# EAGLE schematic TM4C1 (EAGLE 9.6.2)
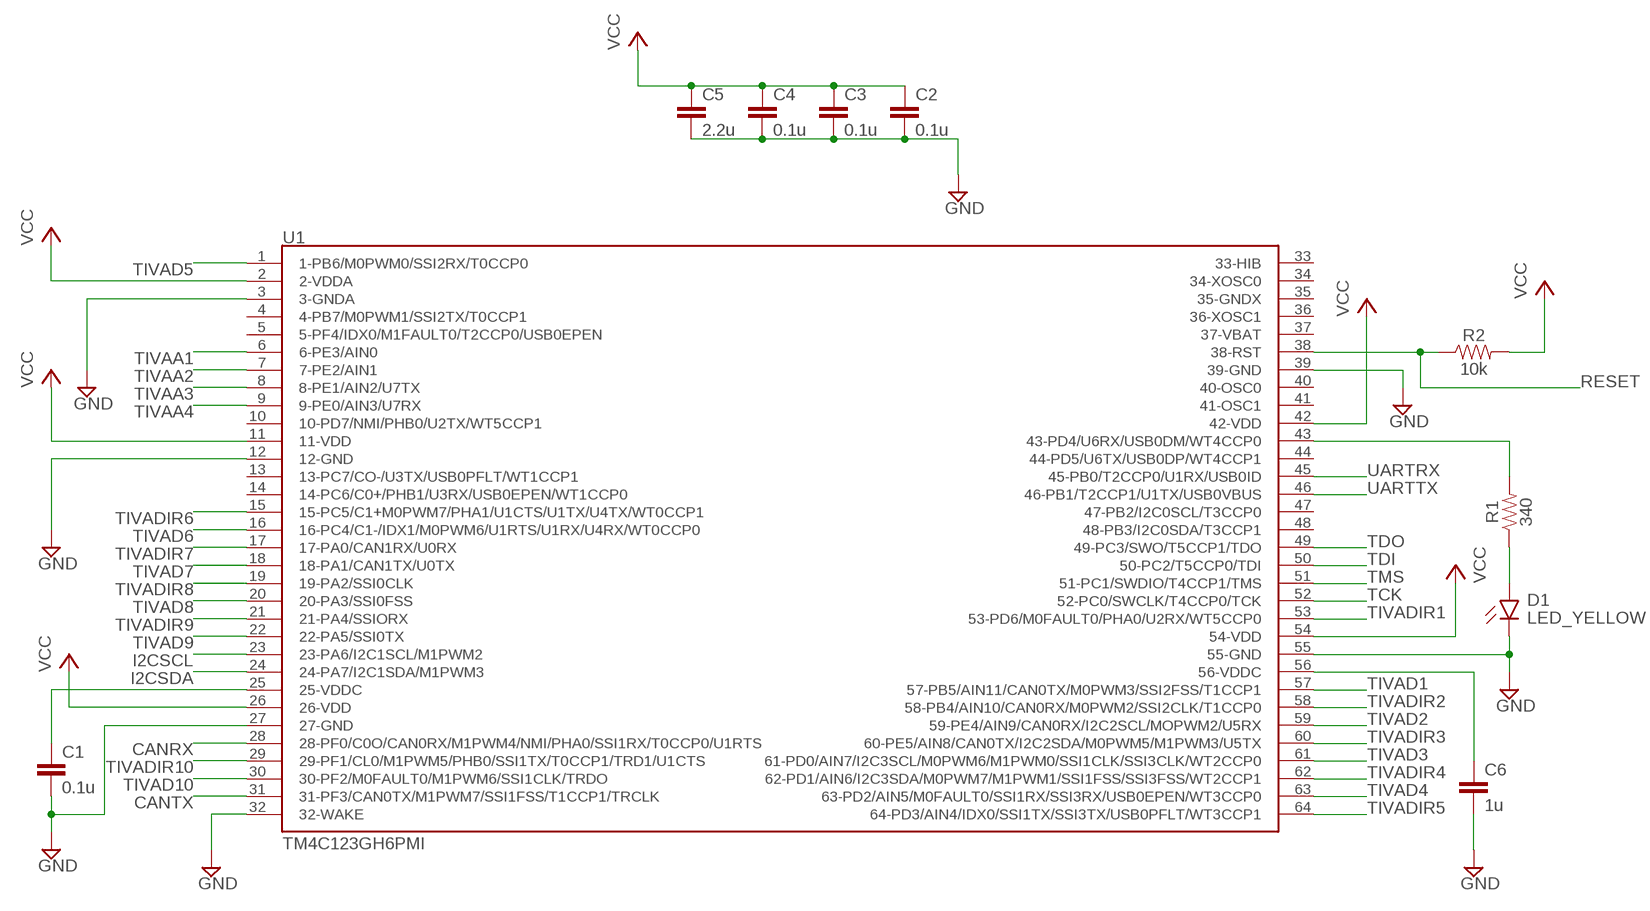
[diagram p0: schematic, sheet 1]

## Parts
C1  0.1u  CAP-0.1UF-0603-25V-X8R  [C0603]
C2  0.1u  CAP-0.1UF-0603-25V-X8R  [C0603]
C3  0.1u  CAP-0.1UF-0603-25V-X8R  [C0603]
C4  0.1u  CAP-0.1UF-0603-25V-X8R  [C0603]
C5  2.2u  CAP-2.2UF-0603-6.3V-X7R  [C0603]
C6  1u  CAP-1UF-0603-25V-X7R  [C0603]
D1  LED_YELLOW  CHIP-FLAT-Y_0603-0.35MM  [LEDC1608X35N_FLAT-Y]
R1  340  RES-340OHM-0603-1/10W-1%  [R0603]
R2  10k  RES-10KOHM-0603-1/10W-1%  [R0603]
U1  TM4C123GH6PMI  [S-PQFP-G64]

## Nets
CANRX: U1.28(28-PF0/C0O/CAN0RX/M1PWM4/NMI/PHA0/SSI1RX/T0CCP0/U1RTS)
CANTX: U1.31(31-PF3/CAN0TX/M1PWM7/SSI1FSS/T1CCP1/TRCLK)
GND: C1.2 C2.2 C3.2 C4.2 C5.2 C6.2 D1.C U1.3(3-GNDA) U1.12(12-GND) U1.27(27-GND) U1.32(32-WAKE) U1.39(39-GND) U1.55(55-GND)
I2CSCL: U1.23(23-PA6/I2C1SCL/M1PWM2)
I2CSDA: U1.24(24-PA7/I2C1SDA/M1PWM3)
N$1: R1.2 U1.43(43-PD4/U6RX/USB0DM/WT4CCP0)
N$2: D1.A R1.1
N$5: C1.1 U1.25(25-VDDC)
N$8: C6.1 U1.56(56-VDDC)
RESET: R2.1 U1.38(38-RST)
TCK: U1.52(52-PC0/SWCLK/T4CCP0/TCK)
TDI: U1.50(50-PC2/T5CCP0/TDI)
TDO: U1.49(49-PC3/SWO/T5CCP1/TDO)
TIVAA1: U1.6(6-PE3/AIN0)
TIVAA2: U1.7(7-PE2/AIN1)
TIVAA3: U1.8(8-PE1/AIN2/U7TX)
TIVAA4: U1.9(9-PE0/AIN3/U7RX)
TIVAD1: U1.57(57-PB5/AIN11/CAN0TX/M0PWM3/SSI2FSS/T1CCP1)
TIVAD2: U1.59(59-PE4/AIN9/CAN0RX/I2C2SCL/MOPWM2/U5RX)
TIVAD3: U1.61(61-PD0/AIN7/I2C3SCL/M0PWM6/M1PWM0/SSI1CLK/SSI3CLK/WT2CCP0)
TIVAD4: U1.63(63-PD2/AIN5/M0FAULT0/SSI1RX/SSI3RX/USB0EPEN/WT3CCP0)
TIVAD5: U1.1(1-PB6/M0PWM0/SSI2RX/T0CCP0)
TIVAD6: U1.16(16-PC4/C1-/IDX1/M0PWM6/U1RTS/U1RX/U4RX/WT0CCP0)
TIVAD7: U1.18(18-PA1/CAN1TX/U0TX)
TIVAD8: U1.20(20-PA3/SSI0FSS)
TIVAD9: U1.22(22-PA5/SSI0TX)
TIVAD10: U1.30(30-PF2/M0FAULT0/M1PWM6/SSI1CLK/TRDO)
TIVADIR1: U1.53(53-PD6/M0FAULT0/PHA0/U2RX/WT5CCP0)
TIVADIR2: U1.58(58-PB4/AIN10/CAN0RX/M0PWM2/SSI2CLK/T1CCP0)
TIVADIR3: U1.60(60-PE5/AIN8/CAN0TX/I2C2SDA/M0PWM5/M1PWM3/U5TX)
TIVADIR4: U1.62(62-PD1/AIN6/I2C3SDA/M0PWM7/M1PWM1/SSI1FSS/SSI3FSS/WT2CCP1)
TIVADIR5: U1.64(64-PD3/AIN4/IDX0/SSI1TX/SSI3TX/USB0PFLT/WT3CCP1)
TIVADIR6: U1.15(15-PC5/C1+M0PWM7/PHA1/U1CTS/U1TX/U4TX/WT0CCP1)
TIVADIR7: U1.17(17-PA0/CAN1RX/U0RX)
TIVADIR8: U1.19(19-PA2/SSI0CLK)
TIVADIR9: U1.21(21-PA4/SSIORX)
TIVADIR10: U1.29(29-PF1/CL0/M1PWM5/PHB0/SSI1TX/T0CCP1/TRD1/U1CTS)
TMS: U1.51(51-PC1/SWDIO/T4CCP1/TMS)
UARTRX: U1.45(45-PB0/T2CCP0/U1RX/USB0ID)
UARTTX: U1.46(46-PB1/T2CCP1/U1TX/USB0VBUS)
VCC: C2.1 C3.1 C4.1 C5.1 R2.2 U1.2(2-VDDA) U1.11(11-VDD) U1.26(26-VDD) U1.42(42-VDD) U1.54(54-VDD)
Unconnected: U1.4(4-PB7/M0PWM1/SSI2TX/T0CCP1) U1.5(5-PF4/IDX0/M1FAULT0/T2CCP0/USB0EPEN) U1.10(10-PD7/NMI/PHB0/U2TX/WT5CCP1) U1.13(13-PC7/CO-/U3TX/USB0PFLT/WT1CCP1) U1.14(14-PC6/C0+/PHB1/U3RX/USB0EPEN/WT1CCP0) U1.33(33-HIB) U1.34(34-XOSC0) U1.35(35-GNDX) U1.36(36-XOSC1) U1.37(37-VBAT) U1.40(40-OSC0) U1.41(41-OSC1) U1.44(44-PD5/U6TX/USB0DP/WT4CCP1) U1.47(47-PB2/I2C0SCL/T3CCP0) U1.48(48-PB3/I2C0SDA/T3CCP1)

## Library data of the parts
C1-C4 = gtsr-passive:CAP-0.1UF: 0.1µF Ceramic Capacitor; MANUFACTURER: Murata Electronics; MFPN: GCM188R91E104KA37D; SUPPLIER: Digi-Key; SUPPLIER_PN: 490-14359-1-ND
C5 = gtsr-passive:CAP-2.2UF: 2.2µF Ceramic Capacitor; AUTOMOTIVE: Yes; MANUFACTURER: Murata; MFPN: GCM188R70J225KE22J; SUPPLIER: Digikey; SUPPLIER_PN: 490-14529-1-ND
C6 = gtsr-passive:CAP-1UF: 1µF Ceramic Capacitor; MANUFACTURER: Murata; MFPN: GCM188R71E105KA64D; SUPPLIER: Digikey; SUPPLIER_PN: 490-10673-1-ND
D1 = LED:CHIP-FLAT-Y; CATEGORY: LED; COLOR: YELLOW; DESCRIPTION: CHIP LED FLAT; SUB-CATEGORY: CHIP; TYPE: FLAT_TOP
R1 = gtsr-passive:RES-340OHM; MANUFACTURER: Panasonic; MFPN: ERJ-3EKF3400V; SUPPLIER: Digikey; SUPPLIER_PN: P340HCT-ND
R2 = gtsr-passive:RES-10KOHM; MANUFACTURER: Panasonic; MFPN: ERJ-3EKF1002V; SUPPLIER: Digikey; SUPPLIER_PN: P10.0KHCT-ND
U1 = gtsr-digital-ic:TM4C1; MFR: Texas Instruments; MPN: TM4C123GH6PMI; SPN: 296-35848-ND; SPR: Digi-Key